# EAGLE design pixelAdapter_f103c8 pro (EAGLE 9.5.2)
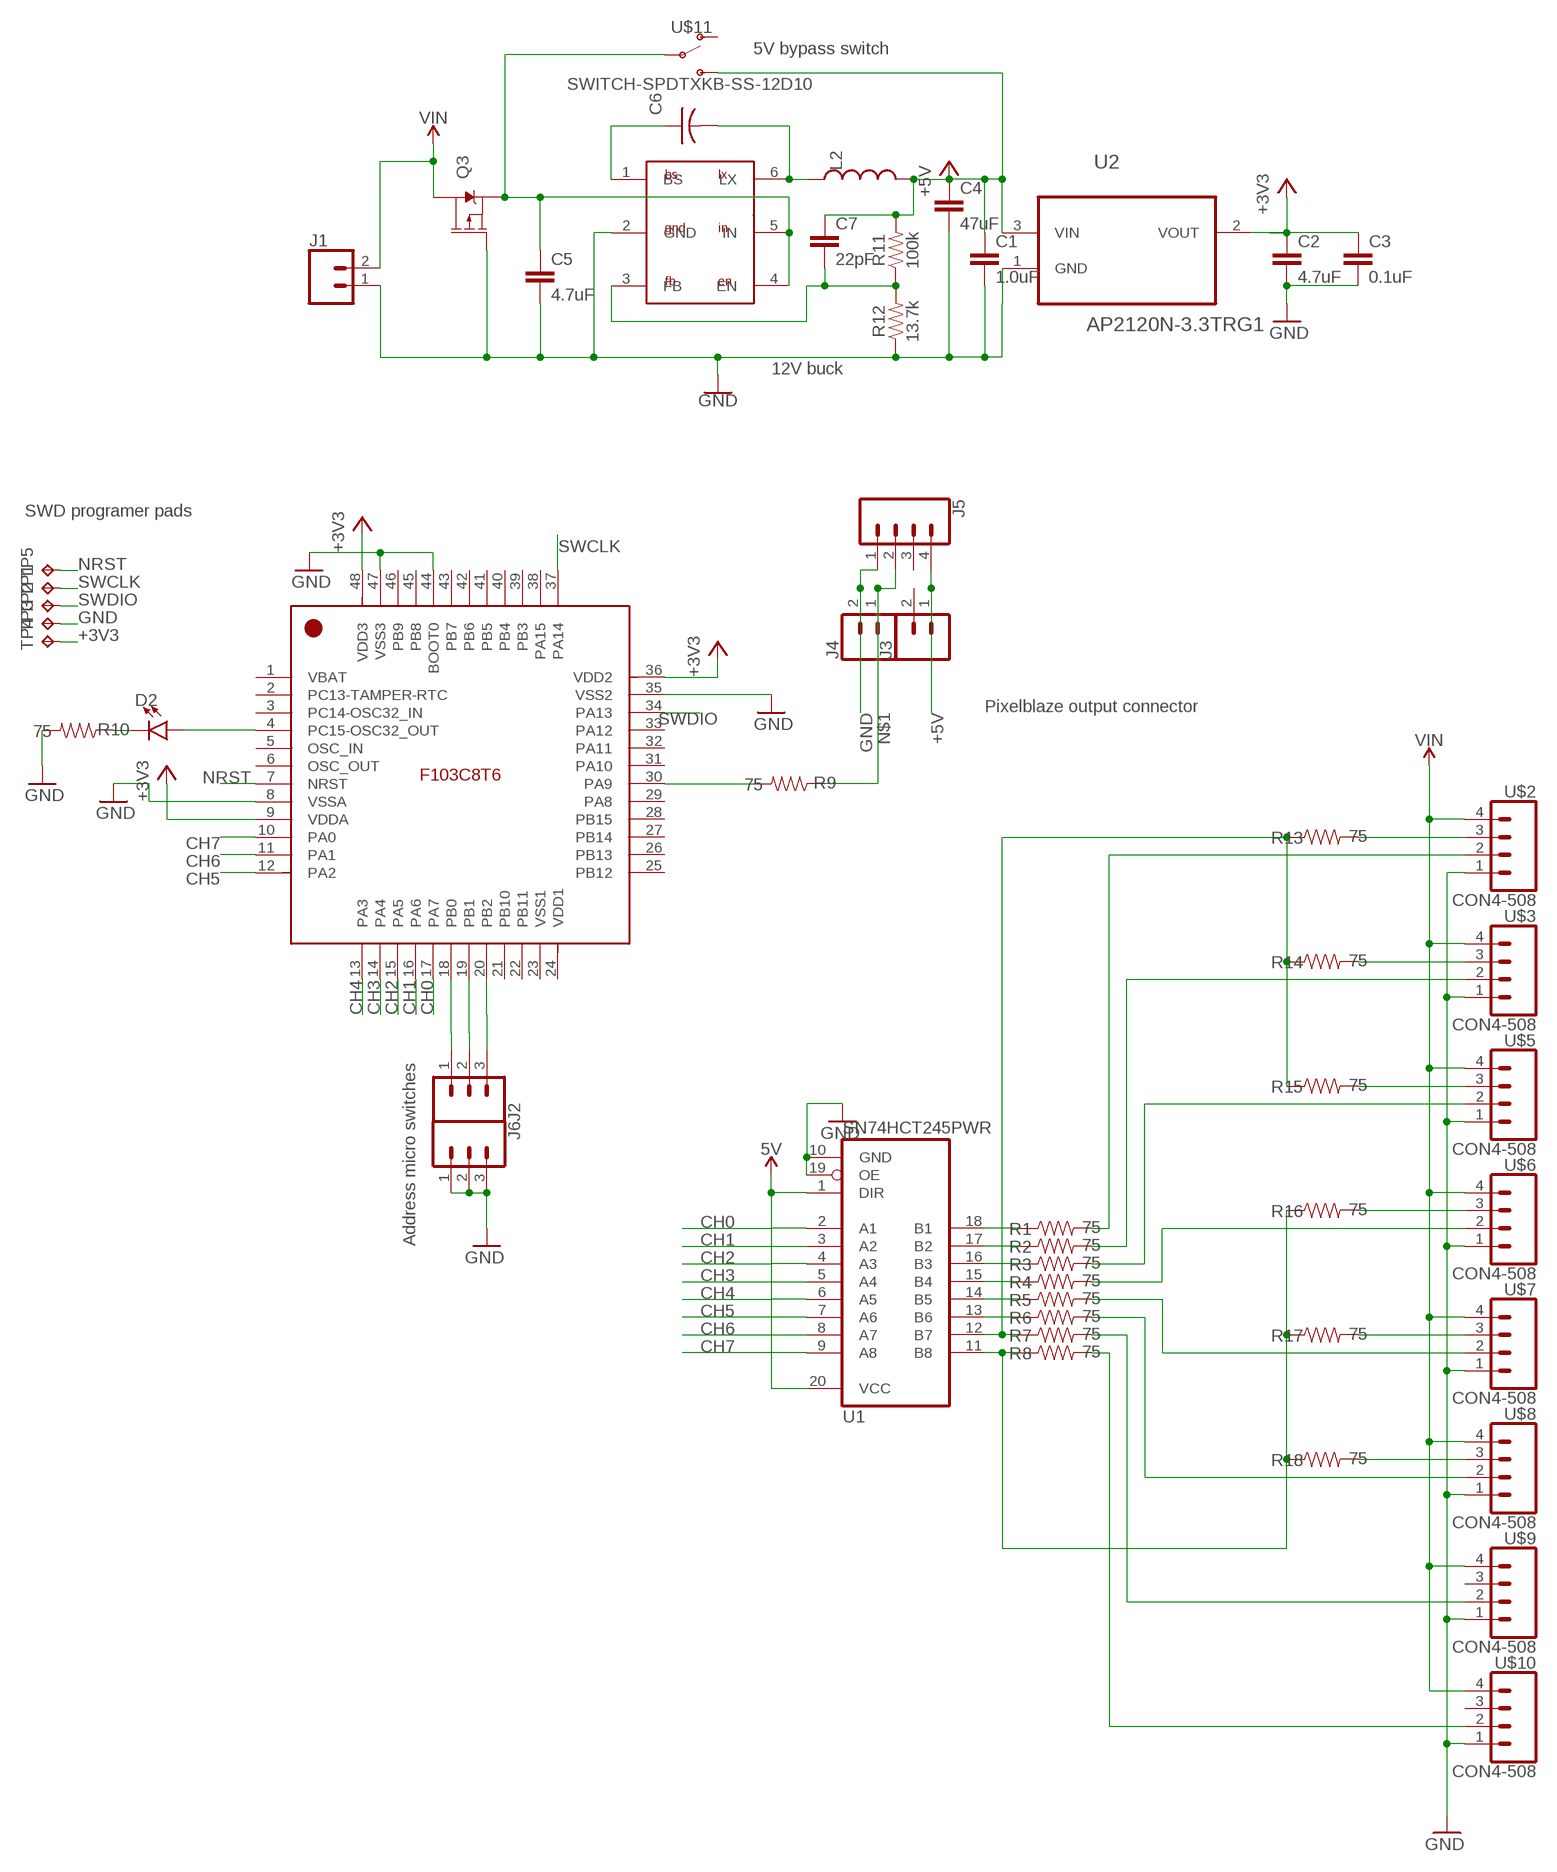
[diagram p0: schematic, sheet 1]

## Parts
C1  1.0uF  1.0UF-0603-16V-10%  [0603]
C2  4.7uF  4.7UF0603  [0603]
C3  0.1uF  0.1UF-0603-25V-(+80/-20%)  [0603]
C4  47uF  4.7UF-1206-16V-(+80/-20%)  [1206]
C5  4.7uF  4.7UF-1206-16V-(+80/-20%)  [1206]
C6  0.1uF  C-USC0402K  [C0402K]
C7  22pF  22PF-0603-50V-5%  [0603]
D2  LED0603  [LED-0603]
J1  CONN_025MM  [SCREWTERMINAL-5MM-2]
J2  CONN_03LOCK  [1X03_LOCK]
J3  CONN_025MM  [SCREWTERMINAL-5MM-2]
J4  CONN_025MM  [SCREWTERMINAL-5MM-2]
J5  CONN_04LOCK  [1X04_LOCK]
J6  CONN_03LOCK  [1X03_LOCK]
L2  INDUCTOR3030  [INDUCTOR-3030]
Q3  2.5A/30V/105mΩ  MOSFET_PCH-DMG2307L  [SOT23-3]
R1  75  100OHM-0603-1/4W-5%  [0603]
R2  75  100OHM-0603-1/4W-5%  [0603]
R3  75  100OHM-0603-1/4W-5%  [0603]
R4  75  100OHM-0603-1/4W-5%  [0603]
R5  75  100OHM-0603-1/4W-5%  [0603]
R6  75  100OHM-0603-1/4W-5%  [0603]
R7  75  100OHM-0603-1/4W-5%  [0603]
R8  75  100OHM-0603-1/4W-5%  [0603]
R9  75  100OHM-0603-1/4W-5%  [0603]
R10  75  100OHM-0603-1/4W-5%  [0603]
R11  100k  100KOHM-0603-1/10W-1%  [0603]
R12  13.7k  13.7KOHM-0603-1/10W-1%  [0603]
R13  75  100OHM-0603-1/4W-5%  [0603]
R14  75  100OHM-0603-1/4W-5%  [0603]
R15  75  100OHM-0603-1/4W-5%  [0603]
R16  75  100OHM-0603-1/4W-5%  [0603]
R17  75  100OHM-0603-1/4W-5%  [0603]
R18  75  100OHM-0603-1/4W-5%  [0603]
TP1  TPTP20SQ  [TP20SQ]
TP2  TPTP20SQ  [TP20SQ]
TP3  TPTP20SQ  [TP20SQ]
TP4  TPTP20SQ  [TP20SQ]
TP5  TPTP20SQ  [TP20SQ]
U1  SN74HCT245PWR  74245PW  [TSSOP20]
U2  AP2120N-3.3TRG1  MCP1700T-3302E/TT  [SOT95P237X112-3N]
U$1  STM32F103C8T6  [LQFP48_7X7MM_0.5MMPP]
U$2  CON4-508  [CON4-508]
U$3  CON4-508  [CON4-508]
U$4  SY8120B1ABC  [SOT23-6]
U$5  CON4-508  [CON4-508]
U$6  CON4-508  [CON4-508]
U$7  CON4-508  [CON4-508]
U$8  CON4-508  [CON4-508]
U$9  CON4-508  [CON4-508]
U$10  CON4-508  [CON4-508]
U$11  SWITCH-SPDTXKB-SS-12D10  [SWITCH-XKB-SS-12D10]

## Nets
+3V3: C2.1 C3.1 TP4.TP U2.2(VOUT) U$1.9(VDDA) U$1.36(VDD2) U$1.48(VDD3)
+5V: C1.1 C4.1 C7.1 J3.1 J5.4 L2.P$2 R11.2 U1.1(DIR) U1.20(VCC) U2.3(VIN) U$11.P$3(S) ; supply symbol labelled 5V
ADDR0: J2.1 U$1.18(PB0)
ADDR1: J2.2 U$1.19(PB1)
ADDR2: J2.3 U$1.20(PB2)
CH0: U1.2(A1) U$1.17(PA7)
CH1: U1.3(A2) U$1.16(PA6)
CH2: U1.4(A3) U$1.15(PA5)
CH3: U1.5(A4) U$1.14(PA4)
CH4: U1.6(A5) U$1.13(PA3)
CH5: U1.7(A6) U$1.12(PA2)
CH6: U1.8(A7) U$1.11(PA1)
CH7: U1.9(A8) U$1.10(PA0)
GND: C1.2 C2.2 C3.2 C4.2 C5.2 J1.1 J4.2 J5.1 J6.1 J6.2 J6.3 Q3.1(G) R10.2 R12.1 TP3.TP U1.10(GND) U1.19(OE) U2.1(GND) U$1.8(VSSA) U$1.35(VSS2) U$1.44(BOOT0) U$1.47(VSS3) U$2.1 U$3.1 U$4.2(GND) U$5.1 U$6.1 U$7.1 U$8.1 U$9.1 U$10.1
LED0: R1.2 U$2.2
LED1: R2.2 U$3.2
LED2: R3.2 U$5.2
LED3: R4.2 U$6.2
LED4: R5.2 U$7.2
LED5: R6.2 U$8.2
LED6: R7.2 U$9.2
LED7: R8.2 U$10.2
LEDS0: R1.1 U1.18(B1)
LEDS1: R2.1 U1.17(B2)
LEDS2: R3.1 U1.16(B3)
LEDS3: R4.1 U1.15(B4)
LEDS4: R5.1 U1.14(B5)
LEDS5: R6.1 U1.13(B6)
LEDS6: R7.1 R13.1 R14.1 R15.1 U1.12(B7)
LEDS7: R8.1 R16.1 R17.1 R18.1 U1.11(B8)
N$1: J4.1 J5.2 R9.1
N$3: D2.A U$1.4(PC15-OSC32_OUT)
N$6: R13.2 U$2.3
N$7: R14.2 U$3.3
N$8: C6.1 U$4.1(BS)
N$9: C6.2 L2.P$1 U$4.6(LX)
N$10: C7.2 R11.1 R12.2 U$4.3(FB)
N$11: R15.2 U$5.3
N$20: R16.2 U$6.3
N$21: D2.C R10.1
N$22: R17.2 U$7.3
N$23: R18.2 U$8.3
NRST: TP5.TP U$1.7(NRST)
RX: R9.2 U$1.30(PA9)
SWCLK: TP1.TP U$1.37(PA14)
SWDIO: TP2.TP U$1.34(PA13)
VIN: J1.2 Q3.3(D) U$2.4 U$3.4 U$5.4 U$6.4 U$7.4 U$8.4 U$9.4 U$10.4
VIN1: C5.1 Q3.2(S) U$4.4(EN) U$4.5(IN) U$11.P$2(P)
Unconnected: J3.2 J5.3 U$1.1(VBAT) U$1.2(PC13-TAMPER-RTC) U$1.3(PC14-OSC32_IN) U$1.5(OSC_IN) U$1.6(OSC_OUT) U$1.21(PB10) U$1.22(PB11) U$1.23(VSS1) U$1.24(VDD1) U$1.25(PB12) U$1.26(PB13) U$1.27(PB14) U$1.28(PB15) U$1.29(PA8) U$1.31(PA10) U$1.32(PA11) U$1.33(PA12) U$1.38(PA15) U$1.39(PB3) U$1.40(PB4) U$1.41(PB5) U$1.42(PB6) U$1.43(PB7) U$1.45(PB8) U$1.46(PB9) U$9.3 U$10.3 U$11.P$1(O)

## Notes on the sheet
- 5V bypass switch
- 12V buck
- SWD programer pads
- Pixelblaze output connector
- Address micro switches

## Library data of the parts
C1 = SparkFun-Capacitors:1.0UF: 1µF ceramic capacitors A capacitor is a passive two-terminal electrical component used to store electrical energy temporarily in an electric field.; PROD_ID: CAP-00868
C2 = SparkFun-Capacitors:4.7UF: 4.7µF ceramic capacitors A capacitor is a passive two-terminal electrical component used to store electrical energy temporarily in an electric field.; PROD_ID: CAP-08280
C3 = SparkFun-Capacitors:0.1UF: 0.1µF ceramic capacitors A capacitor is a passive two-terminal electrical component used to store electrical energy temporarily in an electric field.; PROD_ID: CAP-00810
C4 = SparkFun-Capacitors:4.7UF: 4.7µF ceramic capacitors A capacitor is a passive two-terminal electrical component used to store electrical energy temporarily in an electric field.; PROD_ID: CAP-10300; VALUE: 4.7uF
C5 = SparkFun-Capacitors:4.7UF: 4.7µF ceramic capacitors A capacitor is a passive two-terminal electrical component used to store electrical energy temporarily in an electric field.; PROD_ID: CAP-10300
C6 = adafruit:C-US: CAPACITOR, American symbol
C7 = SparkFun-Capacitors:22PF: 22pF ceramic capacitors A capacitor is a passive two-terminal electrical component used to store electrical energy temporarily in an electric field.; PROD_ID: CAP-07876
D2 = SparkFun-LED:LED: LED (Generic) Standard schematic elements and footprints for 5mm, 3mm, 1206, and 0603 sized LEDs. Generic LEDs with no color specified.
J1 J3 J4 = bens:CONN_02: Multi connection point. Often used as Generic Header-pin footprint for 0.1 inch spaced/style header connections On any of the 0.1 inch spaced packages, you can populate with these: Break Away Headers - Straight <https://www.sparkfun.com/products/116> (PRT-00116) Break Away Male Headers - Right Angle <https://www.sparkfun.com/products/553> (PRT-00553) Female Headers <https://www.sparkfun.com/products/115> (PRT-00115) Break Away Headers - Machine Pin <https://www.sparkfun.com/products/117> (PRT-00117) Break Away Female Headers - Swiss Machine Pin <https://www.sparkfun.com/products/743> (PRT-00743) For SCREWTERMINALS and SPRING TERMINALS visit here: Screw Terimnals on SparkFun.com <https://www.sparkfun.com/search/results?term=Screw+Terminals> (5mm/3.5mm/2.54mm spacing) This device is also useful as a general connection point to wire up your design to another part of your project. Our various solder wires solder well into these plated through hole pads. Hook-Up Wire - Assortment (Stranded, 22 AWG) <https://www.sparkfun.com/products/11375> (PRT-11375) Hook-Up Wire - Assortment (Solid Core, 22 AWG) <https://www.sparkfun.com/products/11367> (PRT-11367) View the entire wire category on our website here <https://www.sparkfun.com/categories/141> Special notes: Molex polarized connector foot print use with: PRT-08233 with associated crimp pins and housings. 2.54_SCREWTERM for use with PRT-10571. 3.5mm Screw Terminal footprints for PRT-08084 5mm Screw Terminal footprints for use with PRT-08432; SF_SKU: PRT-08432
J2 J6 = SparkFun-Connectors:CONN_03: Multi connection point. Often used as Generic Header-pin footprint for 0.1 inch spaced/style header connections On any of the 0.1 inch spaced packages, you can populate with these: Break Away Headers - Straight <https://www.sparkfun.com/products/116> (PRT-00116) Break Away Male Headers - Right Angle <https://www.sparkfun.com/products/553> (PRT-00553) Female Headers <https://www.sparkfun.com/products/115> (PRT-00115) Break Away Headers - Machine Pin <https://www.sparkfun.com/products/117> (PRT-00117) Break Away Female Headers - Swiss Machine Pin <https://www.sparkfun.com/products/743> (PRT-00743) Stackable Header - 3 Pin (Female, 0.1") <https://www.sparkfun.com/products/13875> (PRT-13875) For SCREWTERMINALS and SPRING TERMINALS visit here: Screw Terimnals on SparkFun.com <https://www.sparkfun.com/search/results?term=Screw+Terminals> (5mm/3.5mm/2.54mm spacing) This device is also useful as a general connection point to wire up your design to another part of your project. Our various solder wires solder well into these plated through hole pads. Hook-Up Wire - Assortment (Stranded, 22 AWG) <https://www.sparkfun.com/products/11375> (PRT-11375) Hook-Up Wire - Assortment (Solid Core, 22 AWG) <https://www.sparkfun.com/products/11367> (PRT-11367) View the entire wire category on our website here <https://www.sparkfun.com/categories/141> Special notes: Molex polarized connector foot print use with SKU : PRT-08232 with associated crimp pins and housings.
J5 = SparkFun-Connectors:CONN_04: Multi connection point. Often used as Generic Header-pin footprint for 0.1 inch spaced/style header connections On any of the 0.1 inch spaced packages, you can populate with these: Break Away Headers - Straight <https://www.sparkfun.com/products/116> (PRT-00116) Break Away Male Headers - Right Angle <https://www.sparkfun.com/products/553> (PRT-00553) Female Headers <https://www.sparkfun.com/products/115> (PRT-00115) Break Away Headers - Machine Pin <https://www.sparkfun.com/products/117> (PRT-00117) Break Away Female Headers - Swiss Machine Pin <https://www.sparkfun.com/products/743> (PRT-00743) For SCREWTERMINALS and SPRING TERMINALS visit here: Screw Terimnals on SparkFun.com <https://www.sparkfun.com/search/results?term=Screw+Terminals> (5mm/3.5mm/2.54mm spacing) This device is also useful as a general connection point to wire up your design to another part of your project. Our various solder wires solder well into these plated through hole pads. Hook-Up Wire - Assortment (Stranded, 22 AWG) <https://www.sparkfun.com/products/11375> (PRT-11375) Hook-Up Wire - Assortment (Solid Core, 22 AWG) <https://www.sparkfun.com/products/11367> (PRT-11367) View the entire wire category on our website here <https://www.sparkfun.com/categories/141> Special notes: Molex polarized connector foot print use with SKU : PRT-08231 with associated crimp pins and housings. 1MM SMD Version SKU: PRT-10208; PROD_ID: CONN-09696
L2 = bens:INDUCTOR: ABRACON ASPI-4030S-3R3M-T 4mmx4mm
Q3 = SparkFun-DiscreteSemi:MOSFET_PCH: P-channel MOSFETs Voltage controlled devices that allow control of high current outputs. SparkFun Products: SparkFun ESP32 Thing <https://www.sparkfun.com/products/13907> SparkFun ESP8266 Thing <https://www.sparkfun.com/products/13231>; PROD_ID: TRANS-11308
R1-R10 R13-R18 = SparkFun-Resistors:100OHM: 100Ω resistor A resistor is a passive two-terminal electrical component that implements electrical resistance as a circuit element. Resistors act to reduce current flow, and, at the same time, act to lower voltage levels within circuits. - Wikipedia; PROD_ID: RES-12438; VALUE: 100
R11 = SparkFun-Resistors:100KOHM: 100kΩ resistor A resistor is a passive two-terminal electrical component that implements electrical resistance as a circuit element. Resistors act to reduce current flow, and, at the same time, act to lower voltage levels within circuits. - Wikipedia; PROD_ID: RES-07828
R12 = SparkFun-Resistors:13.7KOHM: 13.7kΩ resistor A resistor is a passive two-terminal electrical component that implements electrical resistance as a circuit element. Resistors act to reduce current flow, and, at the same time, act to lower voltage levels within circuits. - Wikipedia; PROD_ID: RES-08603
TP1-TP5 = testpad:TP: Test pad
U1 = scanlime:74*245: Octal BUS TRANSCEIVER, 3-state
U2 = Microchip_By_element14_Batch_1:MCP1700T-3302E/TT: Low Quiescent Current LDO; MPN: MCP1700T-3302E/TT; OC_FARNELL: 1296592; OC_NEWARK: 88H9817; PACKAGE: SOT23-3; SUPPLIER: Microchip
U$1 = STM32F103C8T6:STM32F103C8T6; AVAILABILITY: Unavailable; DESCRIPTION: Mainstream Performance line, ARM Cortex-M3 MCU with 64 Kbytes Flash, 72 MHz CPU, motor control, USB and CAN; MF: STMicroelectronics; MP: STM32F103C8T6; PACKAGE: LQFP-48 STMicroelectronics; PRICE: None
U$2 U$3 U$5-U$10 = bens:CON4-508
U$4 = bens:SY8120B1ABC
U$11 = bens:SWITCH-SPDT

## Board
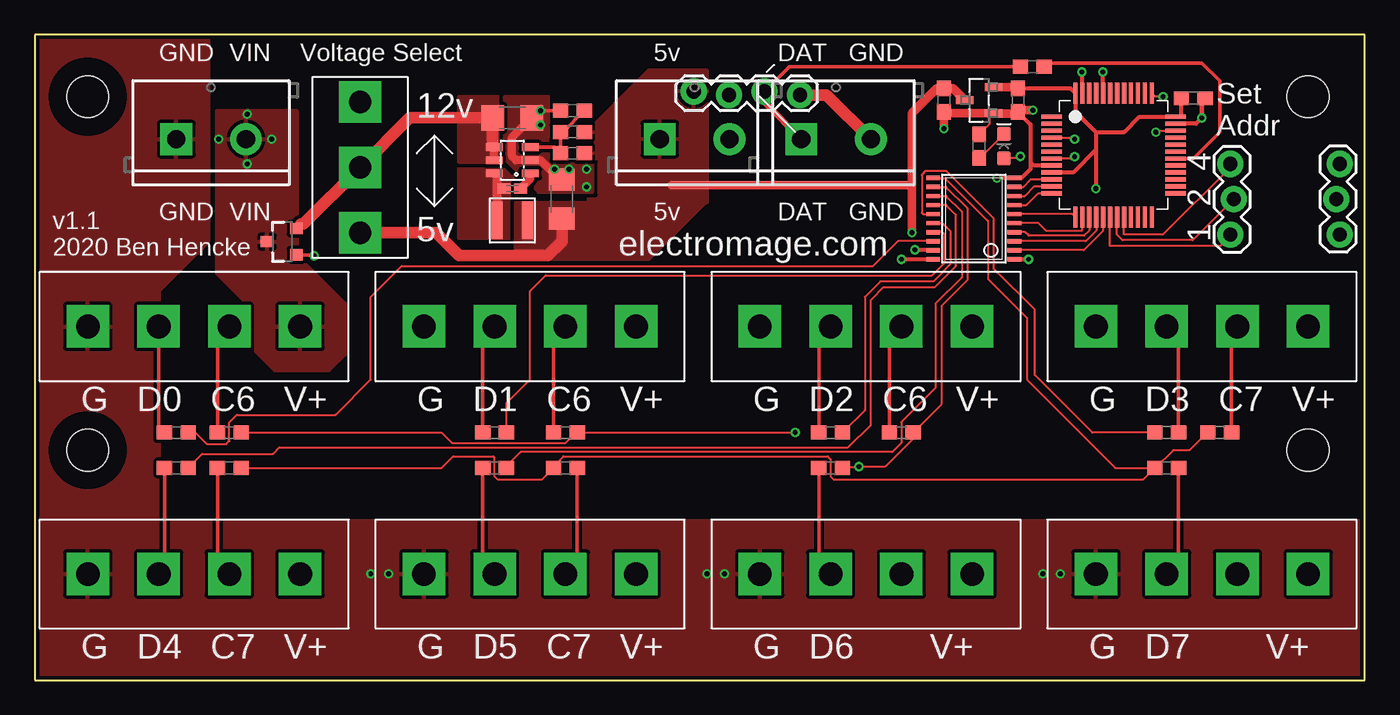
[diagram p1: board, top side]
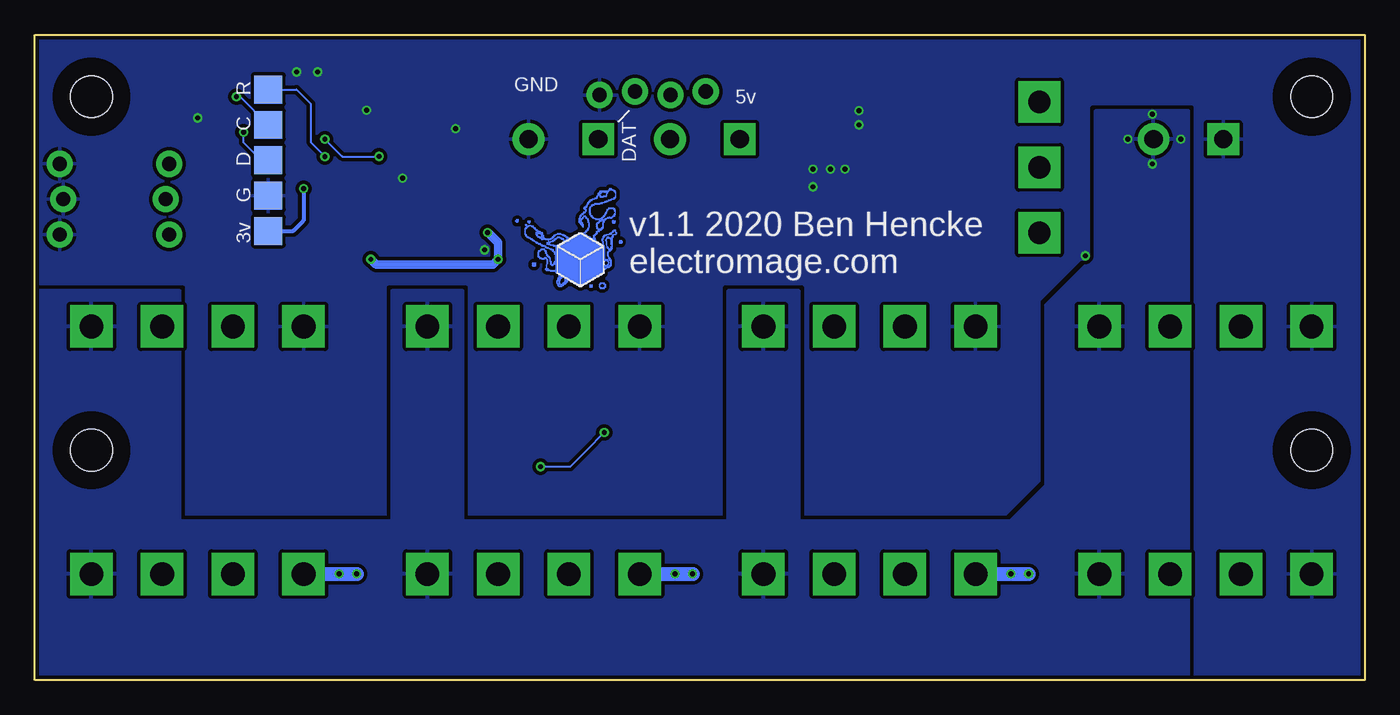
[diagram p2: board, bottom side, seen from below]

Size 95.5 x 46.35 mm. Coordinates in mm from the lower left corner, seen from the top.
Outline: 0,0 95.5,0 95.5,46.35 0,46.35 0,0
Copper layers (1*16): Top 0.035mm / dielectric 1.5mm / Bottom 0.035mm
Design rules "SparkFun-2-layer-PCBWay-LIMIT": minimum track width 6mil, minimum drill 0.3mm, track to track 6mil, track to pad 6mil, pad to pad 6mil, via to via 6mil, smd to smd 6mil, copper to edge 6mil, drill to drill 6mil, minimum pad ring 6mil, minimum via ring 6mil, stop-mask expansion 4mil, vias tented up to drill 25mil, thermal gap 10mil
Holes 3 mm at 3.81,16.51 91.44,16.51 3.81,41.91 91.44,41.91
tRestrict: area 2.5,15.2 to 5.1,17.8; area 2.5,40.6 to 5.1,43.2; area 90.2,40.6 to 92.7,43.2; area 90.2,15.2 to 92.7,17.8
bRestrict: area 2.5,15.2 to 5.1,17.8; area 2.5,40.6 to 5.1,43.2; area 90.2,40.6 to 92.7,43.2; area 90.2,15.2 to 92.7,17.8

### Footprints (pad centres in the part's own frame; a part is rotated, then mirrored left to right if it is on the bottom)
0603 = smd 1.1 x 1: 1 -0.85,0; 2 0.85,0
1206 = smd 1.6 x 1.8: 1 -1.4,0; 2 1.4,0
C0402K = smd 0.925 x 0.74: 1 -0.6,0; 2 0.6,0
LED-0603 = smd 1 x 1: A -0.877,0; C 0.877,0
SCREWTERMINAL-5MM-2 = drill 1.3 pad 2.286 square: 1 0,0 | drill 1.3 pad 2.286: 2 5,0
1X03_LOCK = drill 1.016 pad 1.88: 1 0,0.127; 2 2.54,-0.127; 3 5.08,0.127
1X04_LOCK = drill 1.016 pad 1.88: 1 0,0.127; 2 2.54,-0.127; 3 5.08,0.127; 4 7.62,-0.127
INDUCTOR-3030 = smd 0.8 x 2.7: P$1 1.1,0; P$2 -1.1,0
SOT23-3 = smd 0.8 x 0.9: 1 -0.95,-1; 2 0.95,-1; 3 0,1.1
TP20SQ = smd 2 x 2: TP 0,0
TSSOP20 = smd 0.305 x 0.991: 1 -2.925,-2.918; 2 -2.275,-2.918; 3 -1.625,-2.918; 4 -0.975,-2.918; 5 -0.325,-2.918; 6 0.325,-2.918; 7 0.975,-2.918; 8 1.625,-2.918; 9 2.275,-2.918; 10 2.925,-2.918; 11 2.925,2.918; 12 2.275,2.918; 13 1.625,2.918; 14 0.975,2.918; 15 0.325,2.918; 16 -0.325,2.918; 17 -0.975,2.918; 18 -1.625,2.918; 19 -2.275,2.918; 20 -2.925,2.918
SOT95P237X112-3N = smd 0.559 x 1.27: 1 -0.94,-1.041; 2 0.94,-1.041; 3 0,1.041
LQFP48_7X7MM_0.5MMPP = smd 1.5 x 0.3: 1 -4.45,2.75; 2 -4.45,2.25; 3 -4.45,1.75; 4 -4.45,1.25; 5 -4.45,0.75; 6 -4.45,0.25; 7 -4.45,-0.25; 8 -4.45,-0.75; 9 -4.45,-1.25; 10 -4.45,-1.75; 11 -4.45,-2.25; 12 -4.45,-2.75; 25 4.45,-2.75; 26 4.45,-2.25; 27 4.45,-1.75; 28 4.45,-1.25; 29 4.45,-0.75; 30 4.45,-0.25; 31 4.45,0.25; 32 4.45,0.75; 33 4.45,1.25; 34 4.45,1.75; 35 4.45,2.25; 36 4.45,2.75 | smd 0.3 x 1.5: 13 -2.75,-4.45; 14 -2.25,-4.45; 15 -1.75,-4.45; 16 -1.25,-4.45; 17 -0.75,-4.45; 18 -0.25,-4.45; 19 0.25,-4.45; 20 0.75,-4.45; 21 1.25,-4.45; 22 1.75,-4.45; 23 2.25,-4.45; 24 2.75,-4.45; 37 2.75,4.45; 38 2.25,4.45; 39 1.75,4.45; 40 1.25,4.45; 41 0.75,4.45; 42 0.25,4.45; 43 -0.25,4.45; 44 -0.75,4.45; 45 -1.25,4.45; 46 -1.75,4.45; 47 -2.25,4.45; 48 -2.75,4.45
CON4-508 = drill 1.7 pad 3.048 square: 1 -7.62,0; 2 -2.54,0; 3 2.54,0; 4 7.62,0
SOT23-6 = smd 0.55 x 1.2: 1 -0.95,-1.3; 2 0,-1.3; 3 0.95,-1.3; 4 0.95,1.3; 5 0,1.3; 6 -0.95,1.3
SWITCH-XKB-SS-12D10 = drill 1.6 pad 3 square: P$1 -4.7,0; P$2 0,0; P$3 4.7,0

### Placement (x,y rotation side)
C1  65.28,41.66 270 top
C2  70.61,41.66 270 top
C3  83.19,41.78 0 top
C4  37.85,34.54 90 top
C5  34.29,40.39 0 top
C6  34.29,35.31 180 top
C7  38.61,37.85 180 top
D2  69.6,38.35 90 top
J1  10.16,38.86 0 top
J2  85.98,32 90 top
J3  44.88,38.86 0 top
J4  55.04,38.86 0 top
J5  54.94,42.16 180 top
J6  93.6,37.08 270 top
L2  34.29,33.02 180 top
Q3  17.78,31.5 90 top
R1  10.16,17.78 180 top
R2  33.02,17.78 180 top
R3  57.15,17.78 180 top
R4  81.28,17.78 0 top
R5  10.16,15.24 180 top
R6  33.02,15.24 180 top
R7  57.15,15.24 180 top
R8  81.28,15.24 0 top
R9  71.63,44.07 0 top
R10  67.82,38.35 90 top
R11  38.61,39.37 0 top
R12  38.61,40.89 0 top
R13  13.97,17.78 180 top
R14  38.1,17.78 180 top
R15  62.23,17.78 180 top
R16  85.09,17.78 0 top
R17  13.97,15.24 180 top
R18  38.1,15.24 0 top
TP1  78.74,39.88 0 bottom
TP2  78.74,37.34 0 bottom
TP3  78.74,34.8 0 bottom
TP4  78.74,32.26 0 bottom
TP5  78.74,42.42 180 bottom
U1  67.44,33.15 90 top
U2  67.82,41.66 90 top
U$1  77.47,37.72 0 top
U$2  11.43,25.4 0 top
U$3  35.56,25.4 0 top
U$4  34.29,37.34 90 top
U$5  59.69,25.4 0 top
U$6  83.82,25.4 0 top
U$7  11.43,7.62 0 top
U$8  35.56,7.62 0 top
U$9  59.69,7.62 0 top
U$10  83.82,7.62 0 top
U$11  23.37,36.83 270 top
U$12  [ELECTRO_MAGE_PCB4_PIXEL_2#PNG]  57.15,31.75 0 bottom

### Tracks (layer width: path | path; a pad name or v marks a point on that pad's centre or on a via)
+3V3  (via drill 0.35)
  Top 0.305: 70.52,42.6 C2.1 74.38,42.51 U$1.48 74.72,40.85 76.2,39.37 | 76.2,39.37 78.23,39.37 79.33,40.47 U$1.36 82.3,40.47 82.3,41.75 C3.1 | 76.2,39.37 76.2,38.1 | U$1.9 74.57,36.47 76.2,38.1 | 76.2,38.1 v76.2,35.31
  Top 0.61: U2.2 70.52,42.6
  Bottom 0.305: TP4.TP 76.96,32.26 76.2,33.02 v76.2,35.31
+5V  (via drill 0.35)
  Top 0.305: U1.1 v71.37,30.23 | 62.99,40.22 62.99,35.56 v62.99,32.15 | U1.20 v62.23,30.22 v62.23,30.23
  Top 0.559: 37.85,31.5 37.85,31.75
  Top 0.61: v62.99,32.15 62.99,40.22 62.99,40.73 64.77,42.51 C1.1 65.93,42.51 U2.3 | 62.99,35.56 45.72,35.56
  Top 0.813: U$11.P$3 28.83,32.13 30.48,30.48 36.83,30.48 37.85,31.5 | 37.85,31.75 C4.1
  Bottom 0.61: v62.99,32.15 62.95,32.15 62.23,31.43 v62.23,30.23 62.61,29.84 70.99,29.84 v71.37,30.23
  pour Top (isolate 0.254, rank 5, no thermals): 34.54,30.23 34.54,34.29 48.13,34.29 44.07,30.23
  pour Top (isolate 0.254, rank 4): 48.26,34.29 48.26,43.81 44.07,43.81 39.75,39.5 39.75,34.29
ADDR0
  Top 0.152: J2.1 85.85,31.9 85.14,31.19 77.22,31.19 U$1.18
ADDR1
  Top 0.152: J2.2 83.16,31.6 78.12,31.6 77.72,31.99 U$1.19
ADDR2
  Top 0.152: U$1.20 78.22,32.02 78.23,32 81.03,32 85.85,36.83 J2.3
CH0
  Top 0.152: U$1.17 76.71,33.26 76.71,32.26 75.32,30.87 U1.2
CH1
  Top 0.152: U$1.16 76.22,32.28 75.46,31.52 U1.3
CH2
  Top 0.152: U$1.15 75.72,32.29 75.35,31.92 71.37,31.92 71.12,32.17 U1.4
CH3
  Top 0.152: U$1.14 75.18,33.23 75.18,32.26 72.64,32.26 72.08,32.82 U1.5
CH4
  Top 0.152: U$1.13 74.52,33.47 U1.6
CH5
  Top 0.152: U1.7 71.21,34.12 72.05,34.97 U$1.12
CH6
  Top 0.152: U1.8 71.09,34.77 71.79,35.47 U$1.11
CH7
  Top 0.152: U1.9 70.98,35.42 71.53,35.97 U$1.10
GND  (via drill 0.35)
  Top 0.152: R10.2 68.58,39.97 68.58,40.81 | 35.69,40.89 C5.2
  Top 0.254: Q3.1 20,30.55 v20.07,30.48 | R12.1 35.69,40.89
  Top 0.305: C2.2 71.51,39.91 71.51,37.48 | 71.51,37.48 71.51,36.72 70.86,36.07 U1.10 v69.09,36.07 | 71.51,37.48 71.51,37.22 71.76,36.97 U$1.8 | U2.1 68.77,40.81 68.58,40.81 | v83.82,40.39 83.82,41.57 C3.2 83.78,41.53 83.78,40.36 83.39,39.97 U$1.35 | U$1.47 75.22,43.65 v75.18,43.69 | U$1.44 76.71,42.18 v76.71,43.69 | U1.19 63.23,30.87 v63.2,30.91
  Top 0.559: C5.2 34.29,38.99 34.29,37.59 34.54,37.34 U$4.2 36.32,37.34 37.72,35.94 C4.2
  Top 0.61: v71.68,40.95 70.75,40.95 C2.2 70.48,40.68 69.2,40.68 69.17,40.72 U2.1 65.37,40.72 C1.2 v65.28,39.62
  Top 0.635: C4.2 38.35,35.94 v38.35,36.7 | v36.32,40.89 36.2,40.89 C5.2
  Top 0.813: J5.1 56.87,42.03 J4.2
  Bottom 0.635: U$9.1 v49.53,7.62 | U$10.1 v73.66,7.62
  Bottom 1.016: U$8.1 v24.13,7.62 | U$9.1 v48.26,7.62 | U$10.1 v72.39,7.62
  other vias: 36.32,39.88 37.34,36.7 25.4,7.62 39.62,36.7 39.62,35.43
  pour Bottom (isolate 0.254, rank 6): 0,46.48 95.25,46.48 95.25,0 0,0
  pour Top (isolate 0.254): 95.25,11.43 95.25,0 0,0 0,46.23 12.45,46.23 12.45,31.5 8.89,27.94 8.89,11.43
  pour Top (isolate 0.254, no thermals): 33.78,41.91 36.83,41.91 36.83,40.26 40.01,37.08 40.01,35.05 36.2,35.05 33.78,37.47
LED0
  Top 0.254: R1.2 8.89,18.2 U$2.2
LED1
  Top 0.254: R2.2 32.17,24.55 U$3.2
LED2
  Top 0.254: R3.2 56.3,24.55 U$5.2
LED3
  Top 0.254: R4.2 82.13,24.55 U$6.2
LED4
  Top 0.254: R5.2 9.31,8.04 U$7.2
LED5
  Top 0.254: R6.2 32.17,8.47 U$8.2
LED6
  Top 0.254: R7.2 56.3,8.47 U$9.2
LED7
  Top 0.254: R8.2 82.13,8.47 U$10.2
LEDS0
  Top 0.152: U1.18 61.98,31.52 60.2,29.74 26.36,29.74 24.13,27.52 24.13,21.59 21.59,19.05 14.5,19.05 13.97,18.52 13.97,17.17 13.75,16.95 12.36,16.95 11.53,17.78 R1.1
LEDS1
  Top 0.152: U1.17 65.19,32.17 65.34,32.01 65.34,29.98 64.43,29.07 36.69,29.07 35.56,27.94 35.56,21.59 33.87,19.9 R2.1
LEDS2
  Top 0.152: U1.16 65.19,32.82 65.75,32.26 65.75,29.87 64.52,28.64 60.72,28.64 59.6,27.52 59.6,19.39 R3.1
LEDS3
  Top 0.152: U1.15 63.8,33.47 63.69,33.57 63.69,36.31 63.94,36.55 65.48,36.55 68.87,33.16 68.87,29.54 71.81,26.6 71.81,21.91 75.95,17.78 R4.1
LEDS4
  Top 0.152: U1.14 65.44,34.12 66.16,33.4 66.16,29.75 64.63,28.23 60.96,28.23 60.03,27.3 60.03,18.34 58.4,16.71 17.56,16.71 17.11,16.26 12.03,16.26 R5.1
LEDS5
  Top 0.152: U1.13 65.44,34.77 66.56,33.65 66.56,28.92 64.69,27.04 64.69,20.99 62.23,18.54 62.23,17.04 61.58,16.39 34.89,16.39 33.87,15.37 R6.1
LEDS6  (via drill 0.35)
  Top 0.152: R14.1 38.86,17.78 | 38.86,17.78 38.52,17.78 38.86,17.78 | 38.86,17.78 v54.61,17.78 | R13.1 29.21,17.78 29.97,17.02 38.1,17.02 38.86,17.78 | U1.12 65.44,35.42 66.97,33.89 66.97,28.72 65.11,26.86 65.11,19.81 R15.1 63.08,17.36 61.05,15.33 v59.18,15.33 58.09,15.33 R7.1
  Bottom 0.152: v54.61,17.78 55.88,16.51 57.06,15.33 v59.18,15.33
LEDS7
  Top 0.152: R16.1 84.19,17.78 82.92,16.51 81.75,16.51 80.48,15.24 R8.1 | U1.11 65.37,36.07 68.46,32.99 68.46,28.81 71.25,26.02 71.25,21.58 77.59,15.24 R8.1 | R17.1 29.21,15.24 30.04,16.07 32.93,16.07 32.99,16.01 32.99,14.66 33.24,14.41 36.42,14.41 R18.1 37.25,15.37 37.95,16.07 56.93,16.07 57.15,15.85 57.15,14.63 57.37,14.41 79.6,14.41 R8.1
N$1
  Top 0.254: J5.2 54.18,44.07 R9.1
  Top 0.406: J4.1 52.4,41.5 J5.2
N$3  (via drill 0.35)
  Top 0.152: U$1.4 74.57,38.97 v74.68,38.86 | v70.79,37.62 70.65,37.48 D2.A
  Bottom 0.152: v74.68,38.86 73.43,37.62 v70.79,37.62
N$6
  Top 0.254: R13.2 13.12,24.55 U$2.3
N$7
  Top 0.254: R14.2 37.25,24.55 U$3.3
N$8
  Top 0.559: C6.1 35.59,36.01 U$4.1
N$9
  Top 0.61: U$4.6 33.19,36.19 33.19,35.56 | 33.19,35.56 L2.P$1 | C6.2 33.44,35.31 33.19,35.56
  pour Top (isolate 0.254, rank 6, no thermals): 30.48,36.83 34.29,36.83 34.29,31.75 30.48,31.75
N$10
  Top 0.254: U$4.3 37.32,38.29 C7.2 R11.1 37.93,39.37 R12.2
N$11
  Top 0.254: R15.2 61.38,24.55 U$5.3
N$20
  Top 0.254: R16.2 85.94,24.98 U$6.3
N$21
  Top 0.152: D2.C 67.87,37.5 R10.1
N$22
  Top 0.254: R17.2 13.12,8.47 U$7.3
N$23
  Top 0.254: R18.2 38.95,8.47 U$8.3
NRST  (via drill 0.35)
  Top 0.152: v74.68,37.59 74.55,37.47 U$1.7
  Bottom 0.152: TP5.TP 76.71,42.42 75.69,41.4 75.69,38.65 74.68,37.64 v74.68,37.59
RX
  Top 0.254: R9.2 72.73,44.32 83.82,44.32 85.09,43.05 85.09,39.37 83.19,37.47 U$1.30
SWCLK  (via drill 0.35)
  Top 0.152: v81.03,41.91 80.48,41.91 U$1.37
  Bottom 0.152: TP1.TP 80.77,41.91 v81.03,41.91
SWDIO  (via drill 0.35)
  Top 0.152: v80.52,39.37 80.62,39.47 U$1.34
  Bottom 0.152: TP2.TP 79.25,37.34 80.52,38.61 v80.52,39.37
VIN  (via drill 0.35)
  other vias: 15.24,40.64 15.24,37.08 17.02,38.86 13.21,38.86
  pour Top (isolate 0.254, rank 5): 13.08,40.89 18.8,40.89 18.8,30.48 22.35,26.92 22.35,23.5 21.08,22.23 17.27,22.23 15.24,24.26 15.24,27.05 13.08,29.21
  pour Bottom (isolate 0.254): 12.7,40.89 12.7,0 95.25,0 95.25,11.43 25.4,11.43 22.86,13.97 22.86,26.92 19.3,30.48 19.3,40.89
  pour Bottom (isolate 0.254): 40.64,27.94 45.72,27.94 45.72,7.62 40.64,7.62
  pour Bottom (isolate 0.254): 64.77,27.94 69.85,27.94 69.85,7.62 64.77,7.62
  pour Bottom (isolate 0.254): 85.09,27.94 95.25,27.94 95.25,7.62 85.09,7.62
VIN1
  Top 0.559: U$4.5 U$4.4 32.89,38.39
  Top 0.635: 19.07,32.74 Q3.2
  Top 0.813: 32.89,38.39 C5.1 26.92,40.39 U$11.P$2 19.28,32.74 19.07,32.74
  pour Top (isolate 0.254, rank 3, no thermals): 33.66,37.21 30.48,37.21 30.48,41.91 33.66,41.91

### Text on the board
tPlace: GND | VIN | Voltage Select | 5v | DAT | GND | 12v | Set / Addr | 4 | 2 | GND | VIN | 5v | DAT | GND | 5v | 1 | v1.1 / 2020 Ben Hencke | electromage.com | G D0 C6 V+ | G D1 C6 V+ | G D2 C6 V+ | G D3 C7 V+ | G D4 C7 V+ | G D5 C7 V+ | G D6 V+ | G D7 V+
bPlace: v1.1 2020 Ben Hencke / electromage.com
_bNames: R | GND | 5v | C | DAT | D | G | 3v